# EAGLE design pca9306-breakout (EAGLE 8.6.1)
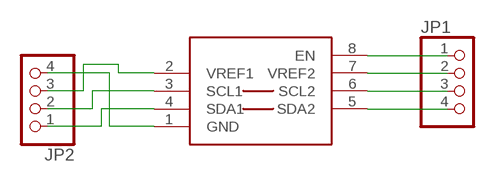
[diagram p0: schematic, sheet 1]

## Parts
JP1  PINHD-1X4  [1X04]
JP2  PINHD-1X4  [1X04]
U11  PCA9306  [PSOP-8]

## Nets
GND: JP2.4 U11.1(GND)
N$2: JP2.1 U11.4(SDA1)
N$3: JP2.2 U11.3(SCL1)
N$4: JP2.3 U11.2(VREF1)
N$5: JP1.1 U11.8(EN)
N$6: JP1.2 U11.7(VREF2)
N$7: JP1.3 U11.6(SCL2)
N$8: JP1.4 U11.5(SDA2)

## Library data of the parts
JP1 JP2 = pinhead:PINHD-1X4: PIN HEADER
U11 = saanlima:PCA9306

## Board
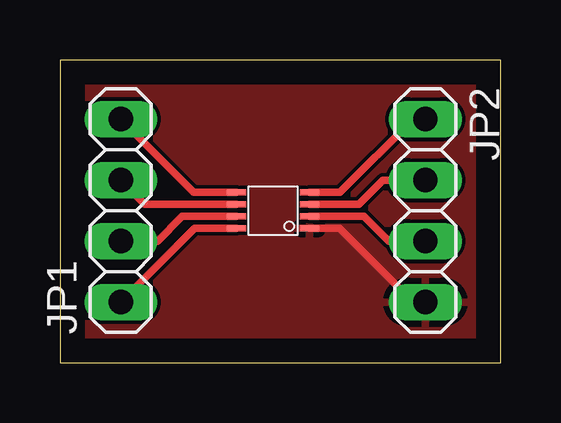
[diagram p1: board, top side]
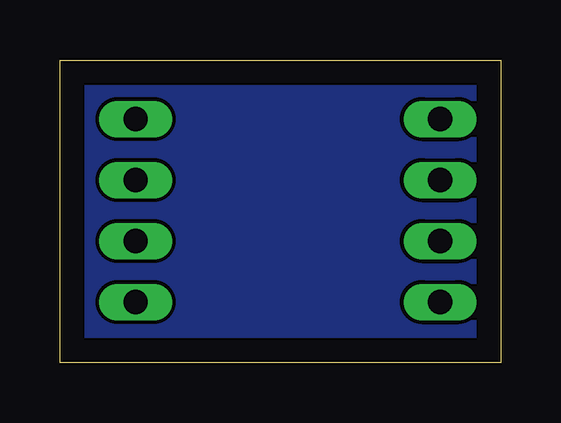
[diagram p2: board, bottom side, seen from below]

Size 18.39 x 12.62 mm. Coordinates in mm from the lower left corner, seen from the top.
Outline: 0,0 18.39,0 18.39,12.62 0,12.62 0,0
Copper layers (1*16): Top 0.035mm / dielectric 1.5mm / Bottom 0.035mm
Design rules "default": minimum track width 6mil, minimum drill 0.35mm, track to track 6mil, track to pad 6mil, pad to pad 6mil, via to via 6mil, smd to smd 6mil, copper to edge 40mil, drill to drill 6mil, minimum pad ring 10mil, minimum via ring 8mil, stop-mask expansion 4mil, vias tented up to drill 0mil, thermal gap 10mil

### Footprints (pad centres in the part's own frame; a part is rotated, then mirrored left to right if it is on the bottom)
1X04 = drill 1.016 long: 1 -3.81,0; 2 -1.27,0; 3 1.27,0; 4 3.81,0
PSOP-8 = smd 0.25 x 0.8: 1 -0.73,-1.52; 2 -0.23,-1.52; 3 0.27,-1.52; 4 0.77,-1.52; 5 0.77,1.53; 6 0.27,1.53; 7 -0.23,1.53; 8 -0.73,1.53

### Placement (x,y rotation side)
JP1  2.54,6.35 90 top
JP2  15.24,6.35 270 top
U11  8.89,6.35 90 top

### Tracks (layer width: path | path; a pad name or v marks a point on that pad's centre or on a via)
GND
  Top 0.305: U11.1 11.65,5.62 14.73,2.54 JP2.4
  pour Top: 0,12.7 18.29,12.7 18.29,0 0,0
N$1
  pour Bottom: 0,12.7 18.29,12.7 18.29,0 0,0
N$2
  Top 0.305: U11.4 11.68,7.12 11.68,7.11 14.73,10.16 JP2.1
N$3
  Top 0.305: U11.3 12.46,6.62 13.46,7.62 JP2.2
N$4
  Top 0.305: U11.2 12.68,6.12 13.72,5.08 JP2.3
N$5
  Top 0.305: JP1.1 5.62,5.62 U11.8
N$6
  Top 0.305: JP1.2 4.06,5.08 5.1,6.12 U11.7
N$7
  Top 0.305: JP1.3 3.54,6.62 U11.6
N$8
  Top 0.305: JP1.4 5.58,7.12 U11.5